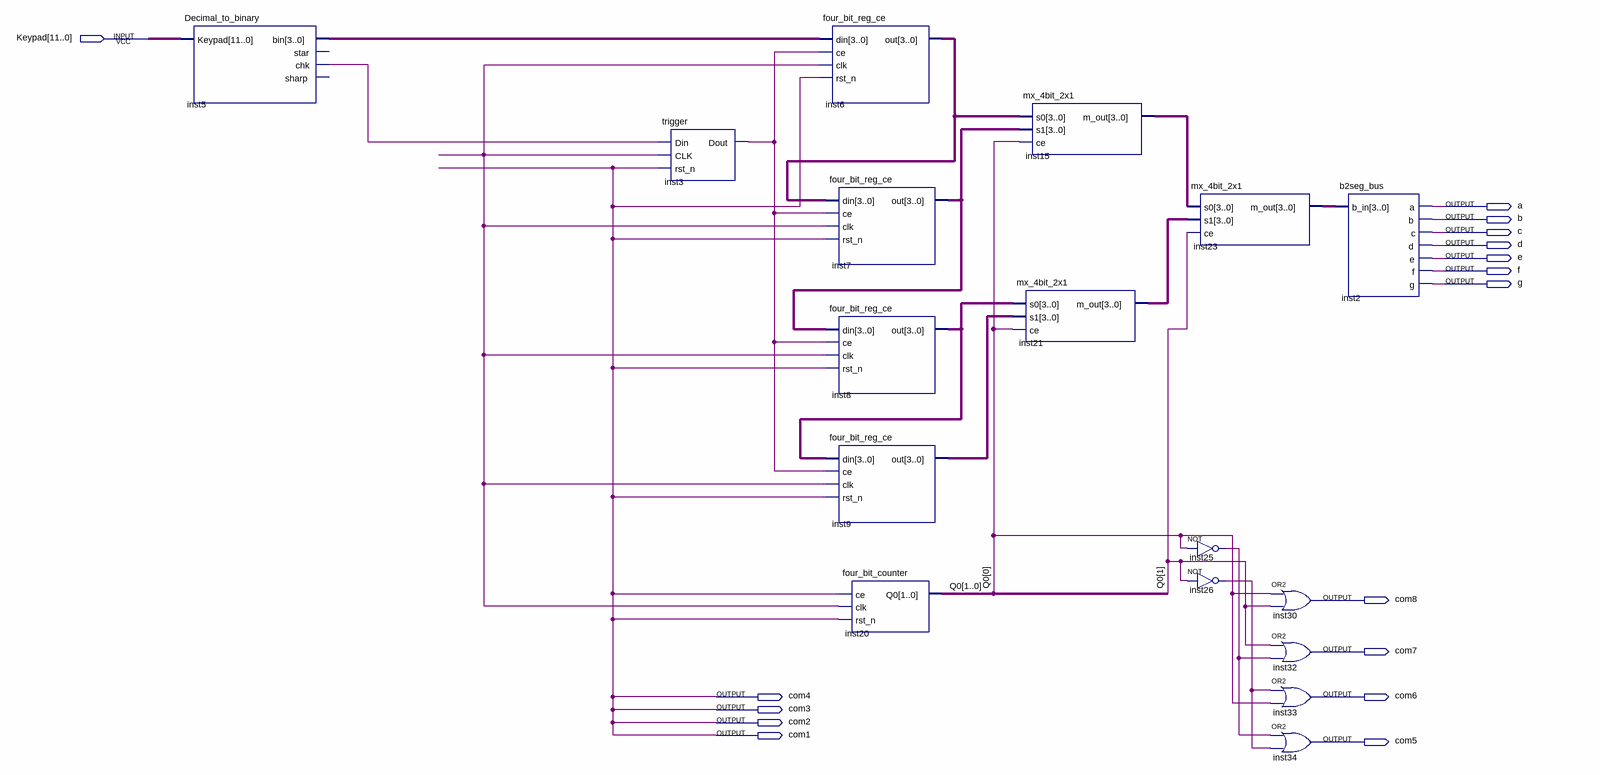
[diagram p0: schematic sheet]
// Quartus schematic b2cpractice.bdf as structural Verilog: 17 symbols, 16 pins
module b2cpractice (
  input  [11:0] Keypad,
  output a,
  output b,
  output c,
  output d,
  output e,
  output f,
  output g,
  output com8,
  output com7,
  output com4,
  output com6,
  output com3,
  output com2,
  output com1,
  output com5
);

  wire inst3_dout, inst5_chk, inst25_out, inst26_out, undriven;
  wire [1:0] Q0;
  wire [3:0] inst5_bin, inst6_out, inst7_out, inst8_out, inst9_out, inst15_m_out, inst21_m_out, inst23_m_out;

  Decimal_to_binary inst5 (.Keypad(Keypad), .bin(inst5_bin), .chk(inst5_chk));  // open: star, sharp
  trigger inst3 (.Din(inst5_chk), .CLK(undriven), .rst_n(com1), .Dout(inst3_dout));
  four_bit_reg_ce inst6 (.din(inst5_bin), .ce(inst3_dout), .clk(undriven), .rst_n(com1), .out(inst6_out));
  four_bit_reg_ce inst7 (.din(inst6_out), .ce(inst3_dout), .clk(undriven), .rst_n(com1), .out(inst7_out));
  four_bit_reg_ce inst8 (.din(inst7_out), .ce(inst3_dout), .clk(undriven), .rst_n(com1), .out(inst8_out));
  four_bit_reg_ce inst9 (.din(inst8_out), .ce(inst3_dout), .clk(undriven), .rst_n(com1), .out(inst9_out));
  four_bit_counter inst20 (.ce(com1), .clk(undriven), .rst_n(com1), .Q0(Q0));
  mx_4bit_2x1 inst15 (.s0(inst6_out), .s1(inst7_out), .ce(Q0[0]), .m_out(inst15_m_out));
  mx_4bit_2x1 inst21 (.s0(inst8_out), .s1(inst9_out), .ce(Q0[0]), .m_out(inst21_m_out));
  mx_4bit_2x1 inst23 (.s0(inst15_m_out), .s1(inst21_m_out), .ce(Q0[1]), .m_out(inst23_m_out));
  not inst25 (inst25_out, Q0[0]);
  not inst26 (inst26_out, Q0[1]);
  or inst30 (com8, Q0[0], Q0[1]);
  or inst32 (com7, Q0[1], inst25_out);
  or inst33 (com6, inst26_out, Q0[0]);
  or inst34 (com5, inst25_out, inst26_out);
  b2seg_bus inst2 (.b_in(inst23_m_out), .a(a), .b(b), .c(c), .d(d), .e(e), .f(f), .g(g));

  assign com2 = com1;
  assign com3 = com1;
  assign com4 = com1;
endmodule
